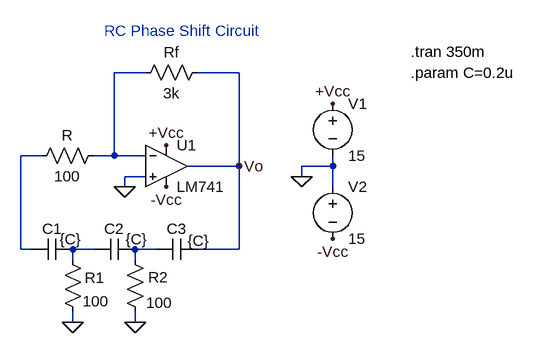
[diagram p0: schematic RCPhaseShift.asc]
RCPhaseShift.asc, the LTspice schematic file:
Version 4
SHEET 1 880 680
WIRE 192 -16 144 -16
WIRE 336 -16 272 -16
WIRE 32 112 0 112
WIRE 144 112 144 -16
WIRE 144 112 112 112
WIRE 192 112 144 112
WIRE 336 128 336 -16
WIRE 336 128 256 128
WIRE 480 128 480 112
WIRE 480 128 432 128
WIRE 192 144 160 144
WIRE 432 144 432 128
WIRE 160 160 160 144
WIRE 480 160 480 128
WIRE 0 256 0 112
WIRE 16 256 0 256
WIRE 112 256 80 256
WIRE 208 256 176 256
WIRE 336 256 336 128
WIRE 336 256 272 256
WIRE 80 272 80 256
WIRE 176 272 176 256
WIRE 80 368 80 352
WIRE 176 368 176 352
FLAG 480 32 +Vcc
FLAG 480 240 -Vcc
FLAG 224 96 +Vcc
FLAG 224 160 -Vcc
FLAG 160 160 0
FLAG 176 368 0
FLAG 336 128 Vo
FLAG 80 368 0
FLAG 432 144 0
SYMBOL voltage 480 16 R0
SYMATTR InstName V1
SYMATTR Value 15
SYMBOL voltage 480 144 R0
SYMATTR InstName V2
SYMATTR Value 15
SYMBOL Opamps\\LM741 224 64 R0
SYMATTR InstName U1
SYMBOL res 288 -32 R90
WINDOW 0 0 56 VBottom 2
WINDOW 3 32 56 VTop 2
SYMATTR InstName Rf
SYMATTR Value 3k
SYMBOL res 128 96 R90
WINDOW 0 0 56 VBottom 2
WINDOW 3 32 56 VTop 2
SYMATTR InstName R
SYMATTR Value 100
SYMBOL cap 80 240 R90
WINDOW 0 0 32 VBottom 2
WINDOW 3 -15 3 VTop 2
SYMATTR InstName C1
SYMATTR Value {C}
SYMBOL cap 176 240 R90
WINDOW 0 0 32 VBottom 2
WINDOW 3 -15 -2 VTop 2
SYMATTR InstName C2
SYMATTR Value {C}
SYMBOL cap 272 240 R90
WINDOW 0 0 32 VBottom 2
WINDOW 3 -13 -2 VTop 2
SYMATTR InstName C3
SYMATTR Value {C}
SYMBOL res 64 256 R0
WINDOW 0 34 44 Left 2
WINDOW 3 31 80 Left 2
SYMATTR InstName R1
SYMATTR Value 100
SYMBOL res 160 256 R0
WINDOW 0 36 43 Left 2
WINDOW 3 33 82 Left 2
SYMATTR InstName R2
SYMATTR Value 100
TEXT 600 -48 Left 2 !.tran 350m
TEXT 128 -80 Left 2 ;RC Phase Shift Circuit
TEXT 600 -16 Left 2 !.param C=0.2u

The netlist it stands for:
* RCPhaseShift.asc
V1 +Vcc 0 15
V2 0 -Vcc 15
XU1 0 N001 +Vcc -Vcc Vo LM741  ; pins In+ In- V+ V- OUT
Rf Vo N001 3k
R N001 N002 100
C1 N003 N002 {C}
C2 N004 N003 {C}
C3 Vo N004 {C}
R1 N003 0 100
R2 N004 0 100
.tran 350m
* RC Phase Shift Circuit
.param C=0.2u
.lib LM741.lib
.backanno
.end